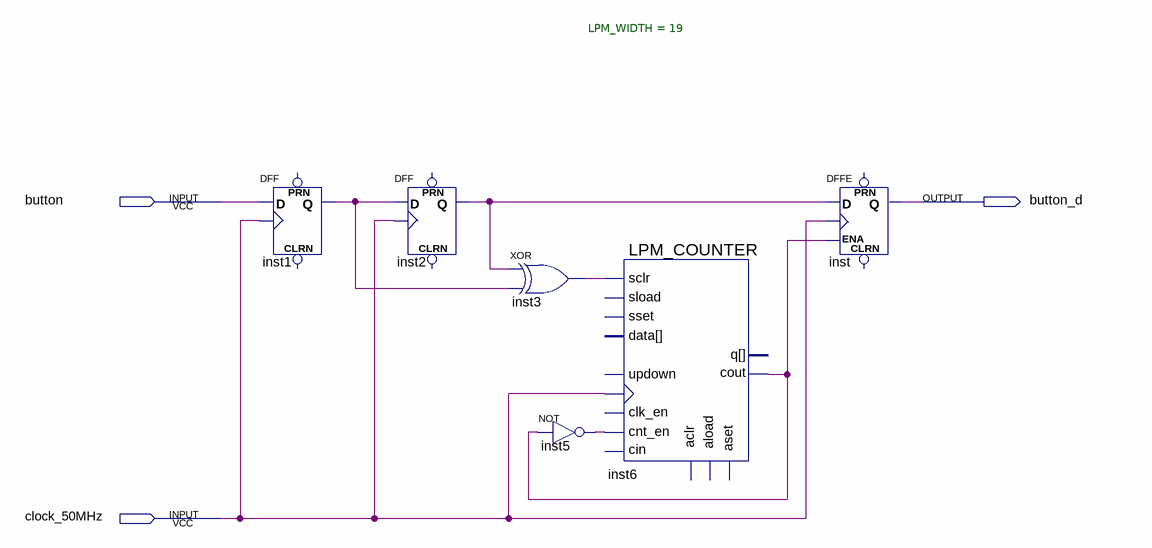
[diagram p0: schematic sheet]
// Quartus schematic debouncer.bdf as structural Verilog: 6 symbols, 3 pins
module debouncer (
  input  button,
  input  clock_50MHz,
  output button_d
);

  wire inst1_q, inst2_q, inst3_out, inst5_out, inst6_cout;

  DFF inst1 (.CLK(clock_50MHz), .D(button), .Q(inst1_q));  // open: CLRN, PRN
  DFF inst2 (.CLK(clock_50MHz), .D(inst1_q), .Q(inst2_q));  // open: CLRN, PRN
  xor inst3 (inst3_out, inst2_q, inst1_q);
  not inst5 (inst5_out, inst6_cout);
  LPM_COUNTER #(.LPM_WIDTH(19)) inst6 (
    .clock(clock_50MHz), .cnt_en(inst5_out), .sclr(inst3_out), .cout(inst6_cout));  // open: sload, data, clk_en, aload, aclr, aset, cin, sset, updown, q
  DFFE inst (.D(inst2_q), .CLK(clock_50MHz), .ENA(inst6_cout), .Q(button_d));  // open: PRN, CLRN
endmodule
